# Altium schematic sheet misc_sensors.SchDoc
size A4; Organization: Badgerloop; Address1: 133 Engineering Research; Address2: Building; Address3: Madison, WI 53715
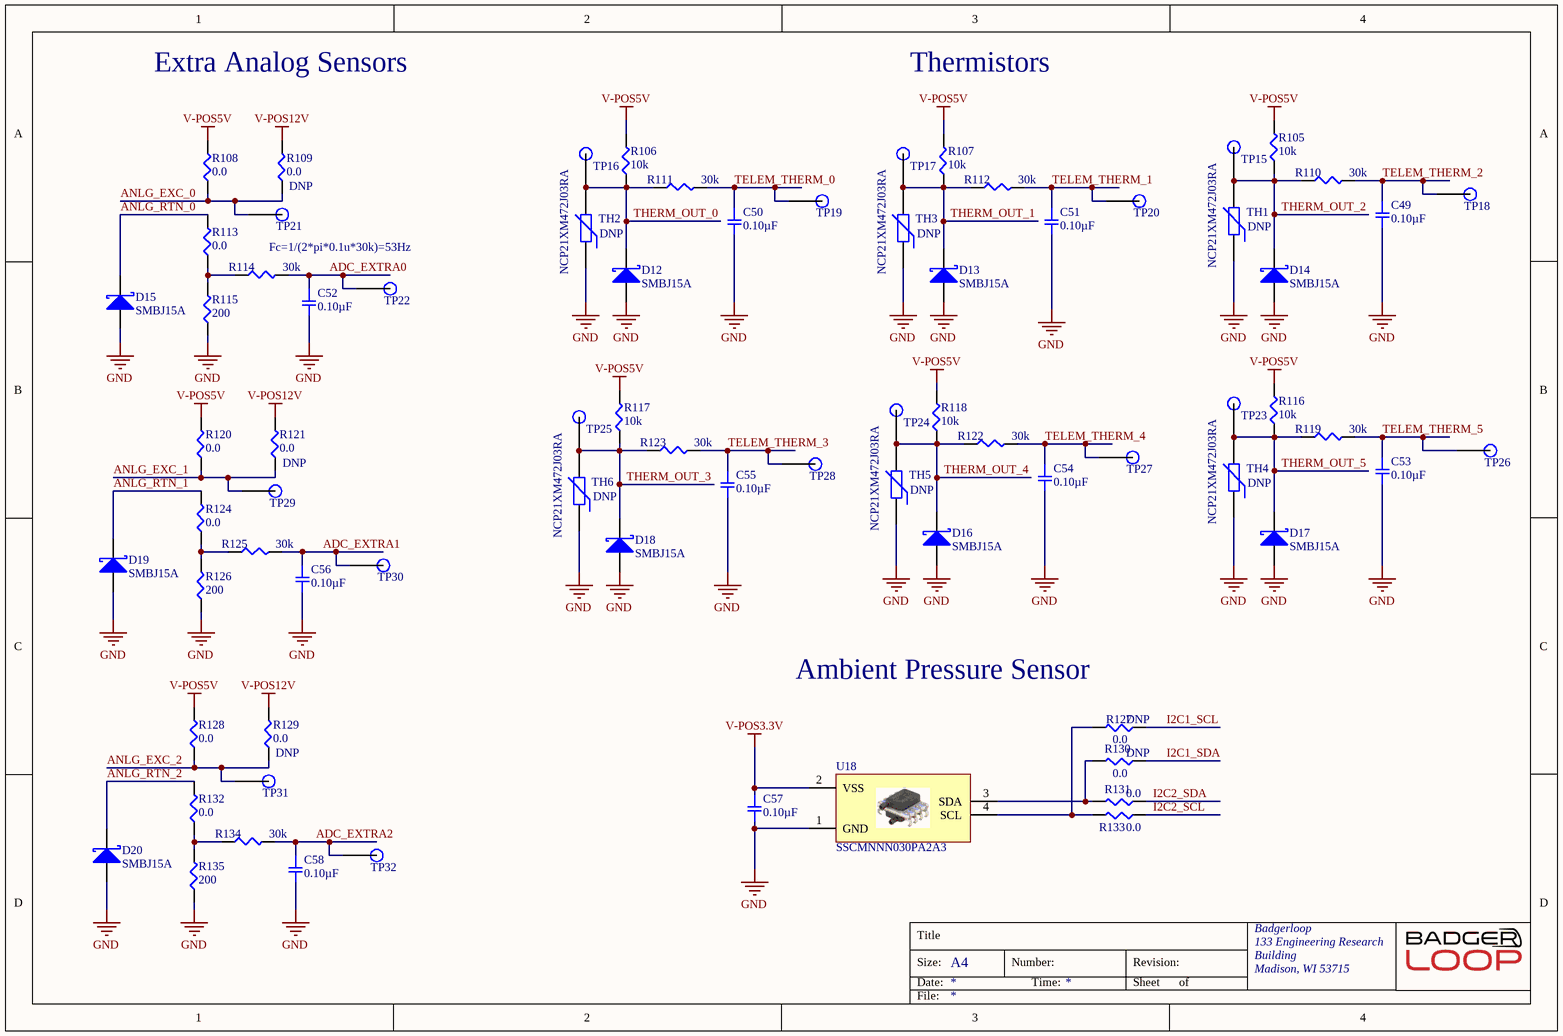
[diagram p0: misc_sensors.SchDoc]

## Parts
C49  0.10µF  [SMD-0805C]
C50  0.10µF  [SMD-0805C]
C51  0.10µF  [SMD-0805C]
C52  0.10µF  [SMD-0805C]
C53  0.10µF  [SMD-0805C]
C54  0.10µF  [SMD-0805C]
C55  0.10µF  [SMD-0805C]
C56  0.10µF  [SMD-0805C]
C57  0.10µF  [SMD-0805C]
C58  0.10µF  [SMD-0805C]
D12  SMBJ15A  [DIOM4436X26N]
D13  SMBJ15A  [DIOM4436X26N]
D14  SMBJ15A  [DIOM4436X26N]
D15  SMBJ15A  [DIOM4436X26N]
D16  SMBJ15A  [DIOM4436X26N]
D17  SMBJ15A  [DIOM4436X26N]
D18  SMBJ15A  [DIOM4436X26N]
D19  SMBJ15A  [DIOM4436X26N]
D20  SMBJ15A  [DIOM4436X26N]
R105  10k  [SMD-0805-RES]
R106  10k  [SMD-0805-RES]
R107  10k  [SMD-0805-RES]
R108  0.0  [SMD-0805-RES]
R109  0.0  [SMD-0805-RES]
R110  30k  [SMD-0805-RES]
R111  30k  [SMD-0805-RES]
R112  30k  [SMD-0805-RES]
R113  0.0  [SMD-0805-RES]
R114  30k  [SMD-0805-RES]
R115  200  [SMD-0805-RES]
R116  10k  [SMD-0805-RES]
R117  10k  [SMD-0805-RES]
R118  10k  [SMD-0805-RES]
R119  30k  [SMD-0805-RES]
R120  0.0  [SMD-0805-RES]
R121  0.0  [SMD-0805-RES]
R122  30k  [SMD-0805-RES]
R123  30k  [SMD-0805-RES]
R124  0.0  [SMD-0805-RES]
R125  30k  [SMD-0805-RES]
R126  200  [SMD-0805-RES]
R127  0.0  [SMD-0805-RES]
R128  0.0  [SMD-0805-RES]
R129  0.0  [SMD-0805-RES]
R130  0.0  [SMD-0805-RES]
R131  0.0  [SMD-0805-RES]
R132  0.0  [SMD-0805-RES]
R133  0.0  [SMD-0805-RES]
R134  30k  [SMD-0805-RES]
R135  200  [SMD-0805-RES]
TH1  NCP21XM472J03RA  [SMD-0805-RES]
TH2  NCP21XM472J03RA  [SMD-0805-RES]
TH3  NCP21XM472J03RA  [SMD-0805-RES]
TH4  NCP21XM472J03RA  [SMD-0805-RES]
TH5  NCP21XM472J03RA  [SMD-0805-RES]
TH6  NCP21XM472J03RA  [SMD-0805-RES]
TP15  TP  [Test Point]  (value not drawn)
TP16  TP  [Test Point]  (value not drawn)
TP17  TP  [Test Point]  (value not drawn)
TP18  TP  [Test Point]  (value not drawn)
TP19  TP  [Test Point]  (value not drawn)
TP20  TP  [Test Point]  (value not drawn)
TP21  TP  [Test Point]  (value not drawn)
TP22  TP  [Test Point]  (value not drawn)
TP23  TP  [Test Point]  (value not drawn)
TP24  TP  [Test Point]  (value not drawn)
TP25  TP  [Test Point]  (value not drawn)
TP26  TP  [Test Point]  (value not drawn)
TP27  TP  [Test Point]  (value not drawn)
TP28  TP  [Test Point]  (value not drawn)
TP29  TP  [Test Point]  (value not drawn)
TP30  TP  [Test Point]  (value not drawn)
TP31  TP  [Test Point]  (value not drawn)
TP32  TP  [Test Point]  (value not drawn)
U18  SSCMNNN030PA2A3  [8-SMT]

## Nets
GND: C49.2 C50.2 C51.2 C52.2 C53.2 C54.2 C55.2 C56.2 C57.2 C58.2 D12.2(K) D13.2(K) D14.2(K) D15.2(K) D16.2(K) D17.2(K) D18.2(K) D19.2(K) D20.2(K) R115.1 R126.1 R135.1 TH1.1 TH2.1 TH3.1 TH4.1 TH5.1 TH6.1 U18.1(GND)
V-POS3.3V: C57.1 U18.2(VSS)
V-POS5V: R105.2 R106.2 R107.2 R108.2 R116.2 R117.2 R118.2 R120.2 R128.2
V-POS12V: R109.2 R121.2 R129.2
ADC_EXTRA0: C52.1 R114.2 TP22.1
ADC_EXTRA1: C56.1 R125.2 TP30.1
ADC_EXTRA2: C58.1 R134.2 TP32.1
ANLG_EXC_0: R108.1 R109.1 TP21.1
ANLG_EXC_1: R120.1 R121.1 TP29.1
ANLG_EXC_2: R128.1 R129.1 TP31.1
ANLG_RTN_0: D15.1(A) R113.2
ANLG_RTN_1: D19.1(A) R124.2
ANLG_RTN_2: D20.1(A) R132.2
I2C1_SCL: R127.1
I2C1_SDA: R130.1
I2C2_SCL: R133.1
I2C2_SDA: R131.1
TELEM_THERM_0: C50.1 R111.2 TP19.1
TELEM_THERM_1: C51.1 R112.2 TP20.1
TELEM_THERM_2: C49.1 R110.2 TP18.1
TELEM_THERM_3: C55.1 R123.2 TP28.1
TELEM_THERM_4: C54.1 R122.2 TP27.1
TELEM_THERM_5: C53.1 R119.2 TP26.1
THERM_OUT_0: D12.1(A) R106.1 R111.1 TH2.2 TP16.1
THERM_OUT_1: D13.1(A) R107.1 R112.1 TH3.2 TP17.1
THERM_OUT_2: D14.1(A) R105.1 R110.1 TH1.2 TP15.1
THERM_OUT_3: D18.1(A) R117.1 R123.1 TH6.2 TP25.1
THERM_OUT_4: D16.1(A) R118.1 R122.1 TH5.2 TP24.1
THERM_OUT_5: D17.1(A) R116.1 R119.1 TH4.2 TP23.1
NetR113_1: R113.1 R114.1 R115.2
NetR124_1: R124.1 R125.1 R126.2
NetR127_2: R127.2 R133.2 U18.4(SCL)
NetR130_2: R130.2 R131.2 U18.3(SDA)
NetR132_1: R132.1 R134.1 R135.2

## Notes on the sheet
- Extra Analog Sensors
- Thermistors
- Fc=1/(2*pi*0.1u*30k)=53Hz
- (near R127) Ambient Pressure Sensor
- Title
- Size:
- Date:
- A4
- Number:
- Time:
- Revision:
- Sheet
- of
- File:

## Library data of the parts
C49-C51 C53-C55 = GRM219R71C104KA01D: CAP CER 0.1UF 16V X7R 0805; Manufacturer: Murata Electronics North America; Factory Stock: 0; Unit Price (USD): 0.13; Minimum Quantity: 1; Tolerance: ±10%; Datasheets: http://www.murata.com/~/media/webrenewal/support/library/catalog/products/capacitor/mlcc/c02e.pdf; Image: //media.digikey.com/Renders/Murata%20Renders/0805%20(2012%20Metric)%20.85mm.jpg; Digi-Key Part Number: 490-1683-1-ND; Part Number: GRM219R71C104KA01D; Quantity Available: 265464; @ qty: 0; Packaging: Cut Tape (CT); Series: GRM; Part Status: Active; Value: 0.10µF; Voltage: 16V; Temperature Coefficient: X7R; Operating Temperature: -55°C ~ 125°C; Features: -; Ratings: -; Applications: General Purpose; Mounting Type: Surface Mount, MLCC; Package / Case: 0805 (2012 Metric); Size / Dimension: 0.079" L x 0.049" W (2.00mm x 1.25mm); Height - Seated (Max): -; Thickness (Max): 0.037" (0.95mm); Lead Spacing: -; Lead Style: -
C52 C56-C58 = GRM219R71E104KA01D: CAP CER 0.1UF 25V X7R 0805; Manufacturer: Murata Electronics North America; Factory Stock: 0; Unit Price (USD): 0.12; Minimum Quantity: 1; Tolerance: ±10%; Datasheets: http://www.murata.com/~/media/webrenewal/support/library/catalog/products/capacitor/mlcc/c02e.pdf; Image: //media.digikey.com/Renders/Murata%20Renders/0805%20(2012%20Metric)%20.85mm.jpg; Digi-Key Part Number: 490-12754-1-ND; Part Number: GRM219R71E104KA01D; Quantity Available: 8594; @ qty: 0; Packaging: Cut Tape (CT); Series: GRM; Part Status: Active; Value: 0.10µF; Voltage: 25V; Temperature Coefficient: X7R; Operating Temperature: -55°C ~ 125°C; Features: -; Ratings: -; Applications: General Purpose; Mounting Type: Surface Mount, MLCC; Package / Case: 0805 (2012 Metric); Size / Dimension: 0.079" L x 0.049" W (2.00mm x 1.25mm); Height - Seated (Max): -; Thickness (Max): 0.037" (0.95mm); Lead Spacing: -; Lead Style: -
D12-D20 = SMBJ15A: TVS DIODE 15V 24.4V DO214AA; Manufacturer: Littelfuse; Direction: Unidirectional; Min Breakdown Voltage: 16.7V; Peak Pulse Power: 600W; Peak Pulse Current: 24.6A; Test Current: 1mA; Number of Elements: 1; Power Line Protection: No; Max Breakdown Voltage: 18.5V; Max Reverse Leakage Current: 1uA; Max Power Dissipation: 5W; Element Configuration: Single; ESD Protection: Yes; Current: 68A; Voltage: 5V; Supplier 1: Digi-Key; Stock 1: 73945; Pricing 1: 1=0.45000, 10=0.33900, 25=0.30520, 100=0.21090, 250=0.17760, 500=0.14430, 1000=0.11100 (USD); RoHS: Yes; Mount: Surface Mount; Case/Package: SMB; Number of Pins: 2; Min Operating Temperature: -65°C; Max Operating Temperature: 150°C; Packaging: Tape and Reel; Reverse Standoff Voltage: 15V; Clamping Voltage: 24.4V; Power Dissipation: 600W; Voltage Rating (DC): 15V; Reverse Breakdown Voltage: 16.7V; Package Quantity: 3000; Operating Supply Voltage: 15V; Max Surge Current: 24.6A; Number of Unidirectional Channels: 1; Breakdown Voltage: 16.7V; Number of Channels: 1; Polarity: Unidirectional; Termination: SMD/SMT; Leakage Current: 1uA; Composition: Zener; Length: 4.57mm; Height: 2.237mm; Width: 3.94mm; Radiation Hardening: No; Lead Free: Lead Free; REACH SVHC: Unknown; ComponentLink1URL: https://datasheet.ciiva.com/34301/1078555-34301957.pdf?src-supplier=Jameco; ComponentLink1Description: https://datasheet.ciiva.com/34301/1078555-34301957.pdf?src-supplier=Jameco; ComponentLink2URL: https://datasheet.ciiva.com/25624/0900766b810f4eeb-25624826.pdf?src-supplier=RSComponents; ComponentLink2Description: https://datasheet.ciiva.com/25624/0900766b810f4eeb-25624826.pdf?src-supplier=RSComponents; ComponentLink3URL: https://datasheet.ciiva.com/46385/13057-46385079.pdf?src-supplier=Element14; ComponentLink3Description: https://datasheet.ciiva.com/46385/13057-46385079.pdf?src-supplier=Element14; ComponentLink4URL: https://datasheet.ciiva.com/331/littelfuse-tvs-diode-smbj-datasheet-pdf-331176.pdf?src-supplier=Digi-Key; ComponentLink4Description: https://datasheet.ciiva.com/331/littelfuse-tvs-diode-smbj-datasheet-pdf-331176.pdf?src-supplier=Digi-Key; ComponentLink5URL: https://datasheet.ciiva.com/331/littelfuse-tvs-diode-smbj-datasheet-pdf-331177.pdf?src-supplier=Digi-Key; ComponentLink5Description: https://datasheet.ciiva.com/331/littelfuse-tvs-diode-smbj-datasheet-pdf-331177.pdf?src-supplier=Digi-Key; ComponentLink6URL: https://datasheet.ciiva.com/331/littelfuse-tvs-diode-smbj-datasheet-pdf-331178.pdf?src-supplier=Digi-Key; ComponentLink6Description: https://datasheet.ciiva.com/331/littelfuse-tvs-diode-smbj-datasheet-pdf-331178.pdf?src-supplier=Digi-Key; Supplier 2: Digi-Key; Stock 2: 69911; Pricing 2: 1=0.35000, 10=0.28700, 25=0.26240, 100=0.19540, 250=0.17704, 500=0.14652, 1000=0.10989 (USD); ComponentLink7URL: https://datasheet.ciiva.com/25624/0900766b810f4eeb-25624712.pdf?src-supplier=RSComponents; ComponentLink7Description: https://datasheet.ciiva.com/25624/0900766b810f4eeb-25624712.pdf?src-supplier=RSComponents; ComponentLink8URL: https://datasheet.ciiva.com/34302/1546929-34302459.pdf?src-supplier=Jameco; ComponentLink8Description: https://datasheet.ciiva.com/34302/1546929-34302459.pdf?src-supplier=Jameco; ComponentLink9URL: https://datasheet.ciiva.com/46381/1677318-46381958.pdf?src-supplier=Element14; ComponentLink9Description: https://datasheet.ciiva.com/46381/1677318-46381958.pdf?src-supplier=Element14; ComponentLink10URL: https://datasheet.ciiva.com/331/littelfuse-tvs-diode-smbj-datasheet-pdf-331131.pdf?src-supplier=Digi-Key; ComponentLink10Description: https://datasheet.ciiva.com/331/littelfuse-tvs-diode-smbj-datasheet-pdf-331131.pdf?src-supplier=Digi-Key; ComponentLink11URL: https://datasheet.ciiva.com/331/littelfuse-tvs-diode-smbj-datasheet-pdf-331132.pdf?src-supplier=Digi-Key; ComponentLink11Description: https://datasheet.ciiva.com/331/littelfuse-tvs-diode-smbj-datasheet-pdf-331132.pdf?src-supplier=Digi-Key; ComponentLink12URL: https://datasheet.ciiva.com/331/littelfuse-tvs-diode-smbj-datasheet-pdf-331133.pdf?src-supplier=Digi-Key; ComponentLink12Description: https://datasheet.ciiva.com/331/littelfuse-tvs-diode-smbj-datasheet-pdf-331133.pdf?src-supplier=Digi-Key; Supplier Part Number 2: SMBJ5.0ALFCT-ND; Supplier Part Number 1: SMBJ15ALFCT-ND
R105-R107 R116-R118 = ERJ-P06F1002V: RES SMD 10K OHM 1% 1/2W 0805; Manufacturer: Panasonic Electronic Components; Factory Stock: 0; Unit Price (USD): 0.02534; @ qty: 1500; Minimum Quantity: 1; Power (Watts): 0.5W, 1/2W; Temperature Coefficient: ±100ppm/°C; Part Number: ERJ-P06F1002V; Datasheets: https://industrial.panasonic.com/cdbs/www-data/pdf/RDA0000/AOA0000C243.pdf; Image: //media.digikey.com/Renders/Panasonic%20Renders/ERJ-0805%20Pkg.jpg; Digi-Key Part Number: P16059CT-ND; Quantity Available: 42054; Packaging: Cut Tape (CT); Series: ERJ; Part Status: Active; Value: 10k; Tolerance: ±1%; Composition: Thick Film; Features: Automotive AEC-Q200, Pulse Withstanding; Operating Temperature: -55°C ~ 155°C; Package / Case: 0805 (2012 Metric); Supplier Device Package: 0805; Size / Dimension: 0.079" L x 0.049" W (2.00mm x 1.25mm); Height - Seated (Max): 0.028" (0.70mm); Number of Terminations: 2; Failure Rate: -
R108 R109 R113 R120 R121 R124 R127-R133 = ERJ-6GEY0R00V: RES SMD 0.0 OHM JUMPER 1/8W 0805; Manufacturer: Panasonic Electronic Components; Factory Stock: 0; Unit Price (USD): 0.00544; @ qty: 1500; Minimum Quantity: 1; Power (Watts): 0.125W, 1/8W; Part Number: ERJ-6GEY0R00V; Datasheets: http://industrial.panasonic.com/www-cgi/jvcr13pz.cgi?E+PZ+3+AOA0001+ERJ6GEY0R00V+7+WW; Image: //media.digikey.com/Renders/Panasonic%20Renders/ERJ-0805%20Pkg.jpg; Digi-Key Part Number: P0.0ACT-ND; Quantity Available: 1597627; Packaging: Cut Tape (CT); Series: ERJ; Part Status: Active; Value: 0.0; Tolerance: Jumper; Composition: Thick Film; Features: Automotive AEC-Q200; Temperature Coefficient: -; Operating Temperature: -55°C ~ 155°C; Package / Case: 0805 (2012 Metric); Supplier Device Package: 0805; Size / Dimension: 0.079" L x 0.049" W (2.00mm x 1.25mm); Height - Seated (Max): 0.028" (0.70mm); Number of Terminations: 2; Failure Rate: -
  R109 R121 R127 R129 R130: DNP: DNP
R110-R112 R114 R119 R122 R123 R125 R134 = ERJ-6ENF3002V: RES SMD 30K OHM 1% 1/8W 0805; Manufacturer: Panasonic Electronic Components; Factory Stock: 0; Unit Price (USD): 0.00729; @ qty: 1500; Minimum Quantity: 1; Power (Watts): 0.125W, 1/8W; Temperature Coefficient: ±100ppm/°C; Part Number: ERJ-6ENF3002V; Datasheets: http://industrial.panasonic.com/www-cgi/jvcr13pz.cgi?E+PZ+3+AOA0002+ERJ6ENF3002V+7+WW; Image: //media.digikey.com/Renders/Panasonic%20Renders/ERJ-0805%20Pkg.jpg; Digi-Key Part Number: P30.0KCCT-ND; Quantity Available: 88046; Packaging: Cut Tape (CT); Series: ERJ; Part Status: Active; Value: 30k; Tolerance: ±1%; Composition: Thick Film; Features: Automotive AEC-Q200; Operating Temperature: -55°C ~ 155°C; Package / Case: 0805 (2012 Metric); Supplier Device Package: 0805; Size / Dimension: 0.079" L x 0.049" W (2.00mm x 1.25mm); Height - Seated (Max): 0.028" (0.70mm); Number of Terminations: 2; Failure Rate: -
R115 R126 R135 = ERJ-P06F2000V: RES SMD 200 OHM 1% 1/2W 0805; Manufacturer: Panasonic Electronic Components; Factory Stock: 0; Unit Price (USD): 0.02534; @ qty: 1500; Minimum Quantity: 1; Power (Watts): 0.5W, 1/2W; Temperature Coefficient: ±100ppm/°C; Part Number: ERJ-P06F2000V; Datasheets: https://industrial.panasonic.com/cdbs/www-data/pdf/RDA0000/AOA0000C243.pdf; Image: //media.digikey.com/Renders/Panasonic%20Renders/ERJ-0805%20Pkg.jpg; Digi-Key Part Number: P16064CT-ND; Quantity Available: 14258; Packaging: Cut Tape (CT); Series: ERJ; Part Status: Active; Value: 200; Tolerance: ±1%; Composition: Thick Film; Features: Automotive AEC-Q200, Pulse Withstanding; Operating Temperature: -55°C ~ 155°C; Package / Case: 0805 (2012 Metric); Supplier Device Package: 0805; Size / Dimension: 0.079" L x 0.049" W (2.00mm x 1.25mm); Height - Seated (Max): 0.028" (0.70mm); Number of Terminations: 2; Failure Rate: -
TH1-TH6 = NCP21XM472J03RA: NTC THERMISTOR 4.7K OHM 5% 0805; Manufacturer: Murata; Resistance: 4.7kR; Power Rating: 200mW; Current Rating: 650uA; Accuracy: 3%; Supplier 1: Digi-Key; Manufacturer Part Number: NCP21XM472J03RA; Stock 1: 51855; Pricing 1: 1=0.20000, 5=0.19400, 10=0.17300, 25=0.15920, 50=0.12760, 100=0.10930, 500=0.09564, 1000=0.08197 (USD); RoHS: Yes; Mount: Surface Mount; Case/Package: 0805; Number of Pins: 2; Case Code (Metric): 2012; Case Code (Imperial): 0805; Min Operating Temperature: -40°C; Max Operating Temperature: 125°C; Tolerance: 5%; Packaging: Tape and Reel; Package Quantity: 4000; Max Power Dissipation: 200mW; Termination: SMD/SMT; Length: 2mm; Height: 0.85mm; Depth: 1.25mm; Width: 1.25mm; Radiation Hardening: No; REACH SVHC: No SVHC; Lead Free: Lead Free; ComponentLink1URL: https://datasheet.ciiva.com/30488/0900766b81259d06-30488337.pdf?src-supplier=RSComponents; ComponentLink1Description: https://datasheet.ciiva.com/30488/0900766b81259d06-30488337.pdf?src-supplier=RSComponents; ComponentLink2URL: https://datasheet.ciiva.com/2848/r44e-2848550.pdf?src-supplier=Digi-Key; ComponentLink2Description: https://datasheet.ciiva.com/2848/r44e-2848550.pdf?src-supplier=Digi-Key; ComponentLink3URL: https://datasheet.ciiva.com/24155/r44e-24155222.pdf?src-supplier=Future+Electronics; ComponentLink3Description: https://datasheet.ciiva.com/24155/r44e-24155222.pdf?src-supplier=Future+Electronics; ComponentLink4URL: https://datasheet.ciiva.com/2848/r44e-2848551.pdf?src-supplier=Digi-Key; ComponentLink4Description: https://datasheet.ciiva.com/2848/r44e-2848551.pdf?src-supplier=Digi-Key; ComponentLink5URL: https://datasheet.ciiva.com/2848/r44e-2848552.pdf?src-supplier=Digi-Key; ComponentLink5Description: https://datasheet.ciiva.com/2848/r44e-2848552.pdf?src-supplier=Digi-Key; ComponentLink6URL: https://datasheet.ciiva.com/16634/l0770c-16634105.pdf?src-supplier=Avnet+Europe; ComponentLink6Description: https://datasheet.ciiva.com/16634/l0770c-16634105.pdf?src-supplier=Avnet+Europe; ComponentLink7URL: https://datasheet.ciiva.com/3280/l0770c-3280522.pdf?src-supplier=Avnet; ComponentLink7Description: https://datasheet.ciiva.com/3280/l0770c-3280522.pdf?src-supplier=Avnet; Supplier Part Number 1: 490-2453-1-ND; DNP: DNP
TP15-TP32 = TP: SMD TEST POINT
U18 = SSCMNNN030PA2A3: Honeywell Digital Pressure Sensor; ComponentLink1Description: Part; ComponentLink1URL: https://www.digikey.com/product-detail/en/honeywell-sensing-and-productivity-solutions/SSCMNNN030PA2A3/480-6407-ND/2416123; ComponentLink2Description: Datasheet; ComponentLink2URL: https://sensing.honeywell.com/index.php?ci_id=151134